# Altium schematic sheet SystemOverview.SchDoc
size A; SheetNumber: 1; SheetTotal: 4
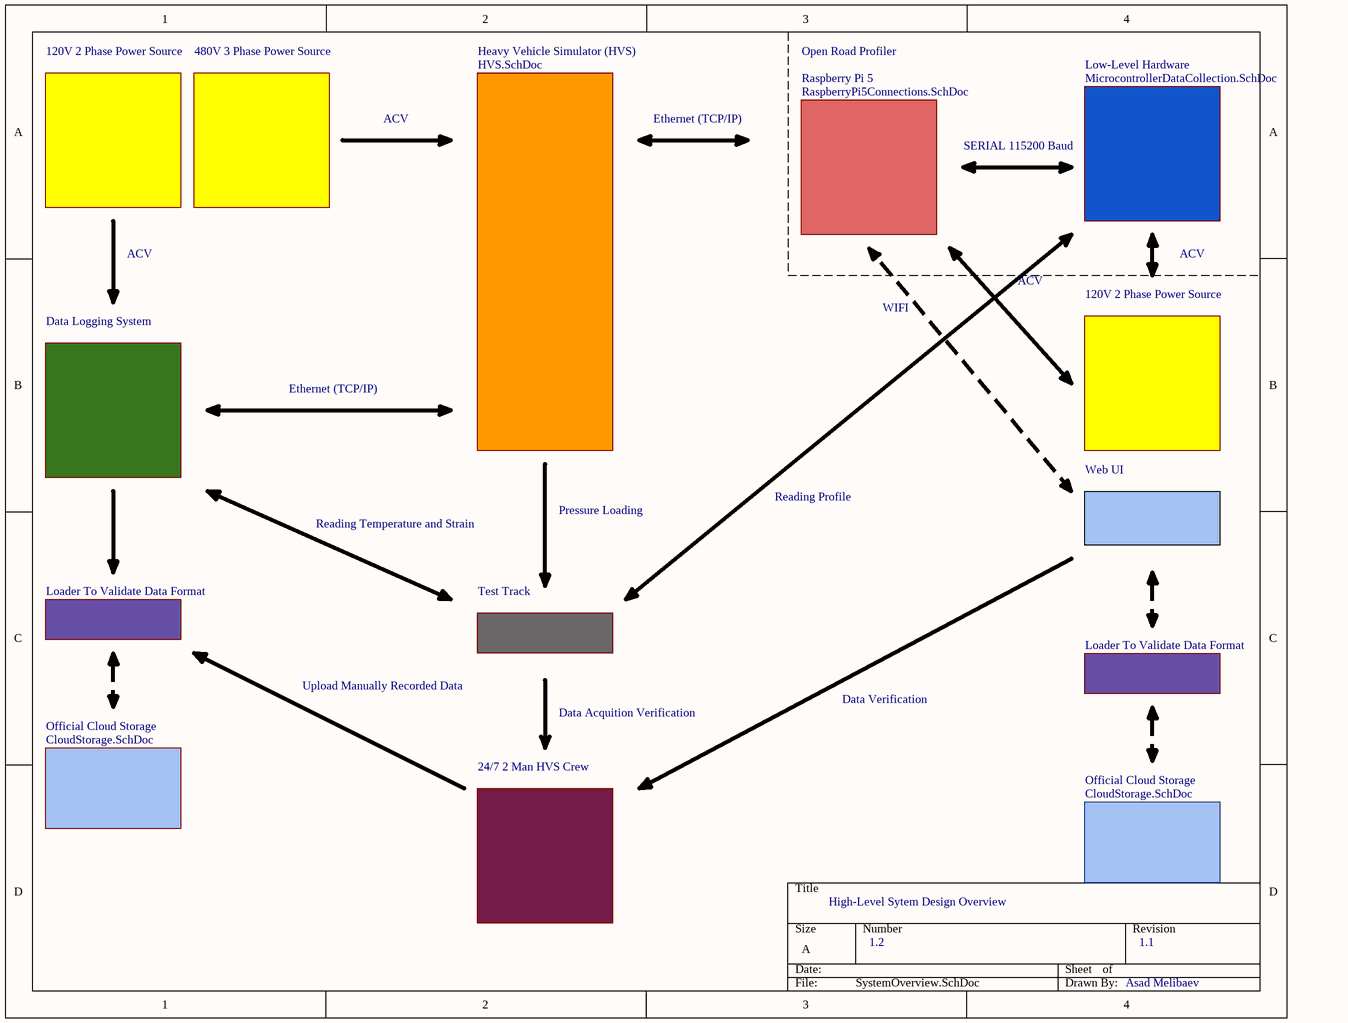
[diagram p0: SystemOverview.SchDoc]

## Sub-sheets
24/7 2 Man HVS Crew = File Name: no entries
120V 2 Phase Power Source = File Name: no entries
120V 2 Phase Power Source = File Name: no entries
480V 3 Phase Power Source = File Name: no entries
Data Logging System = File Name: no entries
Heavy Vehicle Simulator (HVS) = HVS.SchDoc: no entries
Loader To Validate Data Format = File Name: no entries
Loader To Validate Data Format = File Name: no entries
Low-Level Hardware = MicrocontrollerDataCollection.SchDoc: no entries
Official Cloud Storage = CloudStorage.SchDoc: no entries
Official Cloud Storage = CloudStorage.SchDoc: no entries
Raspberry Pi 5 = RaspberryPi5Connections.SchDoc: no entries
Test Track = File Name: no entries
Web UI = File Name: no entries

## Notes on the sheet
- Open Road Profiler
- ACV
- Ethernet (TCP/IP)
- SERIAL 115200 Baud
- WIFI
- Reading Profile
- Reading Temperature and Strain
- Pressure Loading
- Upload Manually Recorded Data
- Data Verification
- Data Acquition Verification
- High-Level Sytem Design Overview
- 1.2
- 1.1
- Asad Melibaev